# EAGLE design PotyEEG_v9 (EAGLE 9.6.2)
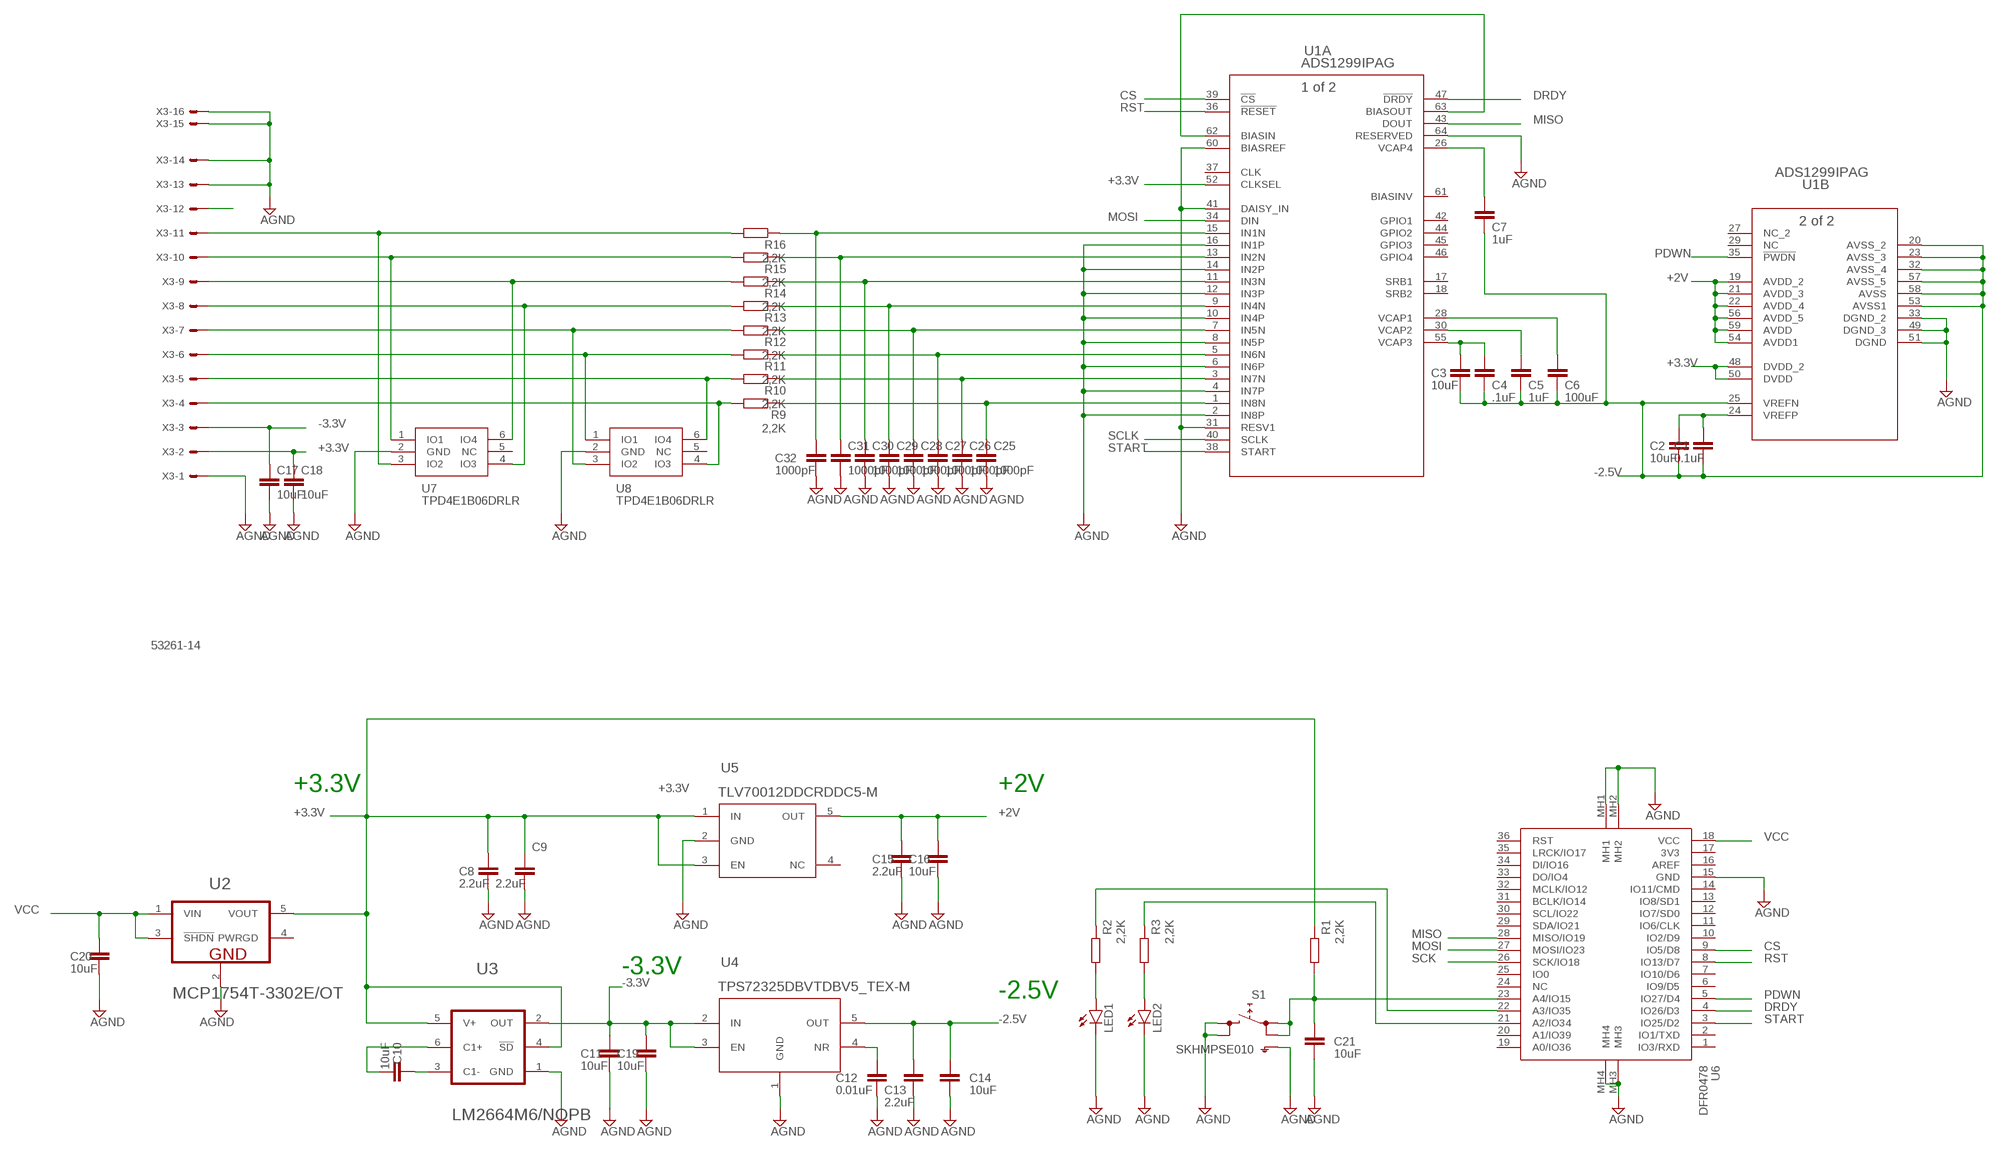
[diagram p0: schematic, sheet 1]

## Parts
C1  0.1uF  C-EUC0805K  [C0805K]
C2  10uF  C-EUC0805K  [C0805K]
C3  10uF  C-EUC0805K  [C0805K]
C4  .1uF  C-EUC0805K  [C0805K]
C5  1uF  C-EUC0805K  [C0805K]
C6  100uF  C-EUC0805K  [C0805K]
C7  1uF  C-EUC0805K  [C0805K]
C8  2.2uF  C-EUC0805K  [C0805K]
C9  2.2uF  C-EUC0805K  [C0805K]
C10  10uF  C-EUC0805K  [C0805K]
C11  10uF  C-EUC0805K  [C0805K]
C12  0.01uF  C-EUC0805K  [C0805K]
C13  2.2uF  C-EUC0805K  [C0805K]
C14  10uF  C-EUC0805K  [C0805K]
C15  2.2uF  C-EUC0805K  [C0805K]
C16  10uF  C-EUC0805K  [C0805K]
C17  10uF  C-EUC0603  [C0603]
C18  10uF  C-EUC0603  [C0603]
C19  10uF  C-EUC0805K  [C0805K]
C20  10uF  C-EUC0805K  [C0805K]
C21  10uF  C-EUC0805K  [C0805K]
C25  1000pF  C-EUC0603  [C0603]
C26  1000pF  C-EUC0603  [C0603]
C27  1000pF  C-EUC0603  [C0603]
C28  1000pF  C-EUC0603  [C0603]
C29  1000pF  C-EUC0603  [C0603]
C30  1000pF  C-EUC0603  [C0603]
C31  1000pF  C-EUC0603  [C0603]
C32  1000pF  C-EUC0603  [C0603]
LED1  LEDSML0805  [SML0805]
LED2  LEDSML0805  [SML0805]
R1  2,2K  R-EU_R0603  [R0603]
R2  2,2K  R-EU_R0603  [R0603]
R3  2,2K  R-EU_R0603  [R0603]
R9  2,2K  R-EU_R0603  [R0603]
R10  2,2K  R-EU_R0603  [R0603]
R11  2,2K  R-EU_R0603  [R0603]
R12  2,2K  R-EU_R0603  [R0603]
R13  2,2K  R-EU_R0603  [R0603]
R14  2,2K  R-EU_R0603  [R0603]
R15  2,2K  R-EU_R0603  [R0603]
R16  2,2K  R-EU_R0603  [R0603]
S1  SKHMPSE010  [SKHMPXE010]
U1  ADS1299IPAG  [PAG64_TEX]
U2  MICROCHIP_MCP1754T-3302E-OTMICROCHIP_MCP1754T-3302E-OT_0_1  [MICROCHIP_MCP1754T-3302E-OT_1]
U3  TEXAS_INSTRUMENTS_LM2664M6-NOPBTEXAS_INSTRUMENTS_LM2664M6-NOPB_0_2  [TEXAS_INSTRUMENTS_LM2664M6-NOPB_2]
U4  TPS72325DBVTDBV5_TEX-M  [DBV5_TEX-M]
U5  TLV70012DDCRDDC5-M  [DDC5-M]
U6  DFR0478  [FIREBEETLE_ESP32]
U7  TPD4E1B06DRLR  [SOP50P160X60-6N]
U8  TPD4E1B06DRLR  [SOP50P160X60-6N]
X3  53261-14  [53261-14]

## Nets
+2V: C15.1 C16.1 U1.19(B:AVDD_2) U1.21(B:AVDD_3) U1.22(B:AVDD_4) U1.54(B:AVDD1) U1.56(B:AVDD_5) U1.59(B:AVDD) U5.5(OUT)
+3.3V: C8.1 C9.1 C18.1 R1.1 U1.48(B:DVDD_2) U1.50(B:DVDD) U1.52(A:CLKSEL) U2.5(VOUT) U3.4(!SD!) U3.5(V+) U5.1(IN) U5.3(EN) X3.2
-2.5V: C1.2 C2.2 C3.2 C4.2 C5.2 C6.2 C7.2 C13.1 C14.1 U1.20(B:AVSS_2) U1.23(B:AVSS_3) U1.25(B:VREFN) U1.32(B:AVSS_4) U1.53(B:AVSS1) U1.57(B:AVSS_5) U1.58(B:AVSS) U4.5(OUT)
-3.3V: C11.1 C17.1 C19.1 U3.2(OUT) U4.2(IN) U4.3(EN) X3.3
CS: U1.39(A:!CS) U6.9(IO5/D8)
DRDY: U1.47(A:!DRDY) U6.4(IO26/D3)
GND: C8.2 C9.2 C11.2 C12.2 C13.2 C14.2 C15.2 C16.2 C17.2 C18.2 C19.2 C20.2 C21.2 C25.2 C26.2 C27.2 C28.2 C29.2 C30.2 C31.2 C32.2 LED1.C LED2.C S1.3(2.1) S1.4(2.2) S1.5(SH) U1.2(A:IN8P) U1.4(A:IN7P) U1.6(A:IN6P) U1.8(A:IN5P) U1.10(A:IN4P) U1.12(A:IN3P) U1.14(A:IN2P) U1.16(A:IN1P) U1.31(A:RESV1) U1.33(B:DGND_2) U1.41(A:DAISY_IN) U1.49(B:DGND_3) U1.51(B:DGND) U1.60(A:BIASREF) U1.64(A:RESERVED) U2.2(GND) U3.1(GND) U4.1(GND) U5.2(GND) U6.15(GND) U6.MH1 U6.MH2 U6.MH3 U6.MH4 U7.2(GND) U8.2(GND) X3.1 X3.13 X3.14 X3.S1 X3.S2 ; supply symbol labelled AGND
MISO: U1.43(A:DOUT) U6.28(MISO/IO19)
MOSI: U1.34(A:DIN) U6.27(MOSI/IO23)
N$1: C1.1 C2.1 U1.24(B:VREFP)
N$2: C3.1 C4.1 U1.55(A:VCAP3)
N$3: C5.1 U1.30(A:VCAP2)
N$4: C6.1 U1.28(A:VCAP1)
N$5: C7.1 U1.26(A:VCAP4)
N$6: C21.1 R1.2 S1.1(1.1) S1.2(1.2) U6.23(A4/IO15)
N$7: X3.12
N$8: R9.2 U8.4(IO3) X3.4
N$9: R10.2 U8.6(IO4) X3.5
N$10: R11.2 U8.1(IO1) X3.6
N$11: R2.1 U6.22(A3/IO35)
N$12: R12.2 U8.3(IO2) X3.7
N$13: C12.1 U4.4(NR)
N$14: R13.2 U7.4(IO3) X3.8
N$15: C10.1 U3.3(C1-)
N$16: C10.2 U3.6(C1+)
N$17: R14.2 U7.6(IO4) X3.9
N$18: LED1.A R2.2
N$19: R15.2 U7.1(IO1) X3.10
N$20: U1.62(A:BIASIN) U1.63(A:BIASOUT)
N$21: R3.1 U6.21(A2/IO34)
N$22: LED2.A R3.2
N$31: C25.1 R9.1 U1.1(A:IN8N)
N$32: C26.1 R10.1 U1.3(A:IN7N)
N$33: C27.1 R11.1 U1.5(A:IN6N)
N$34: C28.1 R12.1 U1.7(A:IN5N)
N$35: C29.1 R13.1 U1.9(A:IN4N)
N$36: C30.1 R14.1 U1.11(A:IN3N)
N$37: C31.1 R15.1 U1.13(A:IN2N)
N$38: C32.1 R16.1 U1.15(A:IN1N)
N$41: R16.2 U7.3(IO2) X3.11
PDWN: U1.35(B:!PWDN) U6.5(IO27/D4)
RST: U1.36(A:!RESET) U6.8(IO13/D7)
SCK: U6.26(SCK/IO18)
SCLK: U1.40(A:SCLK)
START: U1.38(A:START) U6.3(IO25/D2)
VCC: C20.1 U2.1(VIN) U2.3(!SHDN!) U6.18(VCC)
Unconnected: U1.17(A:SRB1) U1.18(A:SRB2) U1.27(B:NC_2) U1.29(B:NC) U1.37(A:CLK) U1.42(A:GPIO1) U1.44(A:GPIO2) U1.45(A:GPIO3) U1.46(A:GPIO4) U1.61(A:BIASINV) U2.4(PWRGD) U5.4(NC) U6.1(IO3/RXD) U6.2(IO1/TXD) U6.6(IO9/D5) U6.7(IO10/D6) U6.10(IO2/D9) U6.11(IO6/CLK) U6.12(IO7/SD0) U6.13(IO8/SD1) U6.14(IO11/CMD) U6.16(AREF) U6.17(3V3) U6.19(A0/IO36) U6.20(A1/IO39) U6.24(NC) U6.25(IO0) U6.29(SDA/IO21) U6.30(SCL/IO22) U6.31(BCLK/IO14) U6.32(MCLK/IO12) U6.33(DO/IO4) U6.34(DI/IO16) U6.35(LRCK/IO17) U6.36(RST) U7.5(NC) U8.5(NC)

## Notes on the sheet
- +3.3V | +2V
- -3.3V
- -2.5V

## Library data of the parts
C1-C21 C25-C32 = rcl:C-EU: CAPACITOR, European symbol; SPICEPREFIX: C
LED1 LED2 = led:LED: LED OSRAM: - CHIPLED LG R971, LG N971, LY N971, LG Q971, LY Q971, LO R971, LY R971 LH N974, LH R974 LS Q976, LO Q976, LY Q976 LO Q996 - Hyper CHIPLED LW Q18S LB Q993, LB Q99A, LB R99A - SideLED LS A670, LO A670, LY A670, LG A670, LP A670 LB A673, LV A673, LT A673, LW A673 LH A674 LY A675 LS A676, LA A676, LO A676, LY A676, LW A676 LS A679, LY A679, LG A679 - Hyper Micro SIDELED® LS Y876, LA Y876, LO Y876, LY Y876 LT Y87S - SmartLED LW L88C, LW L88S LB L89C, LB L89S, LG L890 LS L89K, LO L89K, LY L89K LS L896, LA L896, LO L896, LY L896 - TOPLED LS T670, LO T670, LY T670, LG T670, LP T670 LSG T670, LSP T670, LSY T670, LOP T670, LYG T670 LG T671, LOG T671, LSG T671 LB T673, LV T673, LT T673, LW T673 LH T674 LS T676, LA T676, LO T676, LY T676, LB T676, LH T676, LSB T676, LW T676 LB T67C, LV T67C, LT T67C, LS T67K, LO T67K, LY T67K, LW E67C LS E67B, LA E67B, LO E67B, LY E67B, LB E67C, LV E67C, LT E67C LW T67C LS T679, LY T679, LG T679 LS T770, LO T770, LY T770, LG T770, LP T770 LB T773, LV T773, LT T773, LW T773 LH T774 LS E675, LA E675, LY E675, LS T675 LS T776, LA T776, LO T776, LY T776, LB T776 LHGB T686 LT T68C, LB T68C - Hyper Mini TOPLED® LB M676 - Mini TOPLED Santana® LG M470 LS M47K, LO M47K, LY M47K Source: http://www.osram.convergy.de LUXEON: - LUMILED® LXK2-PW12-R00, LXK2-PW12-S00, LXK2-PW14-U00, LXK2-PW14-V00 LXK2-PM12-R00, LXK2-PM12-S00, LXK2-PM14-U00 LXK2-PE12-Q00, LXK2-PE12-R00, LXK2-PE12-S00, LXK2-PE14-T00, LXK2-PE14-U00 LXK2-PB12-K00, LXK2-PB12-L00, LXK2-PB12-M00, LXK2-PB14-N00, LXK2-PB14-P00, LXK2-PB14-Q00 LXK2-PR12-L00, LXK2-PR12-M00, LXK2-PR14-Q00, LXK2-PR14-R00 LXK2-PD12-Q00, LXK2-PD12-R00, LXK2-PD12-S00 LXK2-PH12-R00, LXK2-PH12-S00 LXK2-PL12-P00, LXK2-PL12-Q00, LXK2-PL12-R00 Source: www.luxeon.com KINGBRIGHT: KA-3528ASYC Source: www.kingbright.com
R1-R3 R9-R16 = rcl:R-EU_: RESISTOR, European symbol; SPICEPREFIX: R
S1 = switch:SKHMP*E010: 6.2 X 6.5mm TACT Switch (SMD) Source: http://www3.alps.co.jp/WebObjects/catalog.woa/PDF/E/Switch/Tact/SKHM/SKHM.PDF
U1 = ads1299 functional:ADS1299IPAG; BUILT_BY: EMA_UL_Team; MANUFACTURER_PART_NUMBER: ADS1299IPAG; SOURCELIBRARY: TI_2015-1-5; VENDOR: Texas Instruments
U2 = MCP1754T-3302:MICROCHIP_MCP1754T-3302E-OT: MCHP-MCP1754-SOT-23-5; CIIVA_IDS: 1500925; COMPONENT_LINK_1_DESCRIPTION: Manufacturer URL; COMPONENT_LINK_1_URL: http://www.microchip.com; COMPONENT_LINK_3_DESCRIPTION: Package Specification; COMPONENT_LINK_3_URL: http://www.microchip.com/stellent/groups/techpub_sg/documents/packagingspec/en012702.pdf; COMPONENT_LINK_4_DESCRIPTION: Product URL; COMPONENT_LINK_4_URL: http://www.microchip.com/MCP1754; DATASHEET: http://ww1.microchip.com/downloads/en/DeviceDoc/22276A.pdf; DATASHEET_VERSION: Rev. A; FOOTPRINT_VARIANT_NAME_0: Level C; FOOTPRINT_VARIANT_NAME_1: Level B; FOOTPRINT_VARIANT_NAME_2: Level A; IMPORTED: yes; IMPORTED_FROM: vault; IMPORT_TS: 1521843520; MF: Microchip; MOUNTING_TECHNOLOGY: Surface Mount; MPN: MCP1754T-3302E/OT; PACKAGE: SOT-23-OT5; PACKAGE_DESCRIPTION: 5-Lead Plastic Small Outline Transistor, 2.9 x 1.55 mm Body, 0.95 mm Pitch; PACKAGE_VERSION: C04-091B; PREFIX: U; RELEASE_DATE: 1359988692; VAULT_GUID: 3A33CF96-43B5-4723-873A-C9F2F5F09FFF; VAULT_REVISION: A9278915-1F13-43B8-98C3-18563D2C7A01
U3 = LM2664:TEXAS_INSTRUMENTS_LM2664M6-NOPB: PM-CHP-LM2664M6-6; CIIVA_IDS: 19361147; CODE__IPC: SOT26A-6; CODE__JEDEC: MO-178-AB; COMPONENT_LINK_1_DESCRIPTION: Datasheet URL; COMPONENT_LINK_1_URL: http://www.ti.com/general/docs/lit/getliterature.tsp?genericPartNumber=LM2664&fileType=pdf; COMP_TYPE: Switch Caps; FOOTPRINT_VARIANT_NAME_0: Level C; FOOTPRINT_VARIANT_NAME_1: Level B; FOOTPRINT_VARIANT_NAME_2: Level A; IMPORTED: yes; IMPORTED_FROM: vault; IMPORT_TS: 1521864087; MF: Texas Instruments; MPN: LM2664M6/NOPB; PACKAGE: DBV0006A; PACKAGE_DESCRIPTION: Molded SOT-23, .115 x .063 x .040in Body, 6 Lead, .0375in in Pitch; PACKAGE_TOP_MARKING: S03A*XTT; PIN_COUNT: 6; POWER_WISE: N; PREFIX: U; RELEASE_DATE: 1464079872; ROHS: Yes; VAULT_GUID: 34B9379D-887B-4667-A034-6510912F99CF; VAULT_REVISION: D99320BA-DF10-4148-ADE2-61DB7AE1F07E
U4 = TPS72325:TPS72325DBVT; BUILT_BY: EMA_UL_Team; MANUFACTURER: Texas Instruments; MANUFACTURER_PART_NUMBER: TPS72325DBVT; SOURCELIBRARY: TI_2014-08-19; VENDOR: Texas Instruments
U5 = TLV70012:TLV70012DDCR; DATASHEET_URL: http://www.ti.com/lit/gpn/TLV70012; DESCRIPTION: 200mA, Low IQ, Low Dropout Regulator for Portables; FAMILY_NAME: SINGLE CHANNEL LDO; GENERIC_PART_NUMBER: TLV70012; INDUSTRY_STD_PKG_TYPE: SOT; MANUFACTURER: Texas Instruments; MANUFACTURER_PART_NUMBER: TLV70012DDCR; PACKAGE_DESIGNATOR: DDC; PIN_COUNT: 5; VENDOR: Texas Instruments
U6 = DFR0478_V2:DFR0478: Development Boards & Kits - Wireless FireBeetle ESP32 IOT MCU Source: Datasheet <https://github.com/Robert-MARKII/Document/blob/master/FireBeetle Board-ESP32 User Manual update.pdf>; ARROW_PART_NUMBER: DFR0478; ARROW_PRICE-STOCK: https://www.arrow.com/en/products/dfr0478/dfrobot; DESCRIPTION: Development Boards & Kits - Wireless FireBeetle ESP32 IOT MCU; HEIGHT: mm; MANUFACTURER_NAME: DFRobot; MANUFACTURER_PART_NUMBER: DFR0478; MOUSER_PART_NUMBER: 426-DFR0478; MOUSER_PRICE-STOCK: https://www.mouser.co.uk/ProductDetail/DFRobot/DFR0478?qs=EU6FO9ffTwc%252BR65h2NUGQw%3D%3D
U7 U8 = TPD4E1B06DRLR:TPD4E1B06DRLR: Bidirectional Quad-Channel High-Speed ESD Protection Device Source: Datasheet <http://www.ti.com/lit/ds/symlink/tpd4e1b06.pdf>; ARROW_PART_NUMBER: TPD4E1B06DRLR; ARROW_PRICE-STOCK: https://www.arrow.com/en/products/tpd4e1b06drlr/texas-instruments; DESCRIPTION: Bidirectional Quad-Channel High-Speed ESD Protection Device; HEIGHT: 0.6mm; MANUFACTURER_NAME: Texas Instruments; MANUFACTURER_PART_NUMBER: TPD4E1B06DRLR; MOUSER_PART_NUMBER: 595-TPD4E1B06DRLR; MOUSER_PRICE-STOCK: https://www.mouser.co.uk/ProductDetail/Texas-Instruments/TPD4E1B06DRLR?qs=1MXlzafEN387aRSX0e2MEQ%3D%3D
X3 = con-molex-53261-14:53?-14: CONNECTOR wire to board 1.25 mm (.049 inch) pitch header; MF: MOLEX; OC_FARNELL: 1125364; OC_NEWARK: unknown

## Board
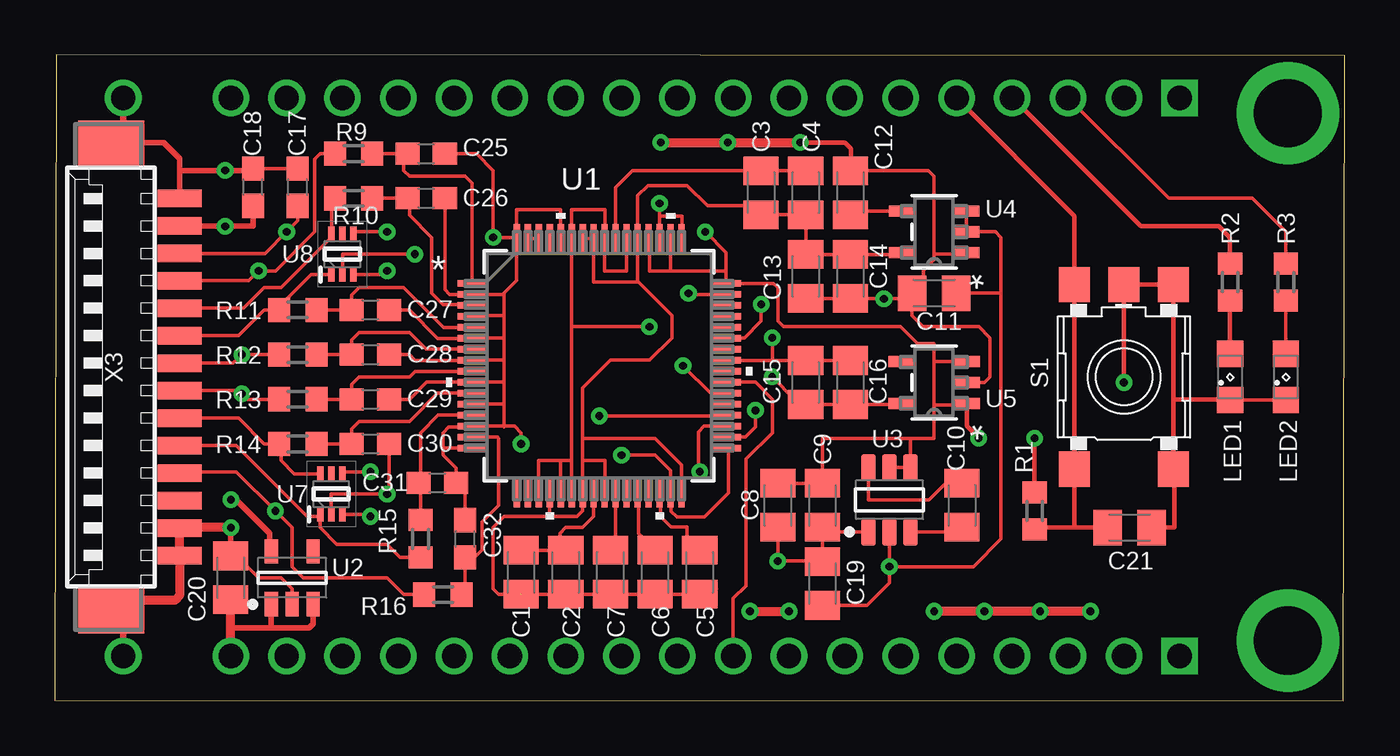
[diagram p1: board, top side]
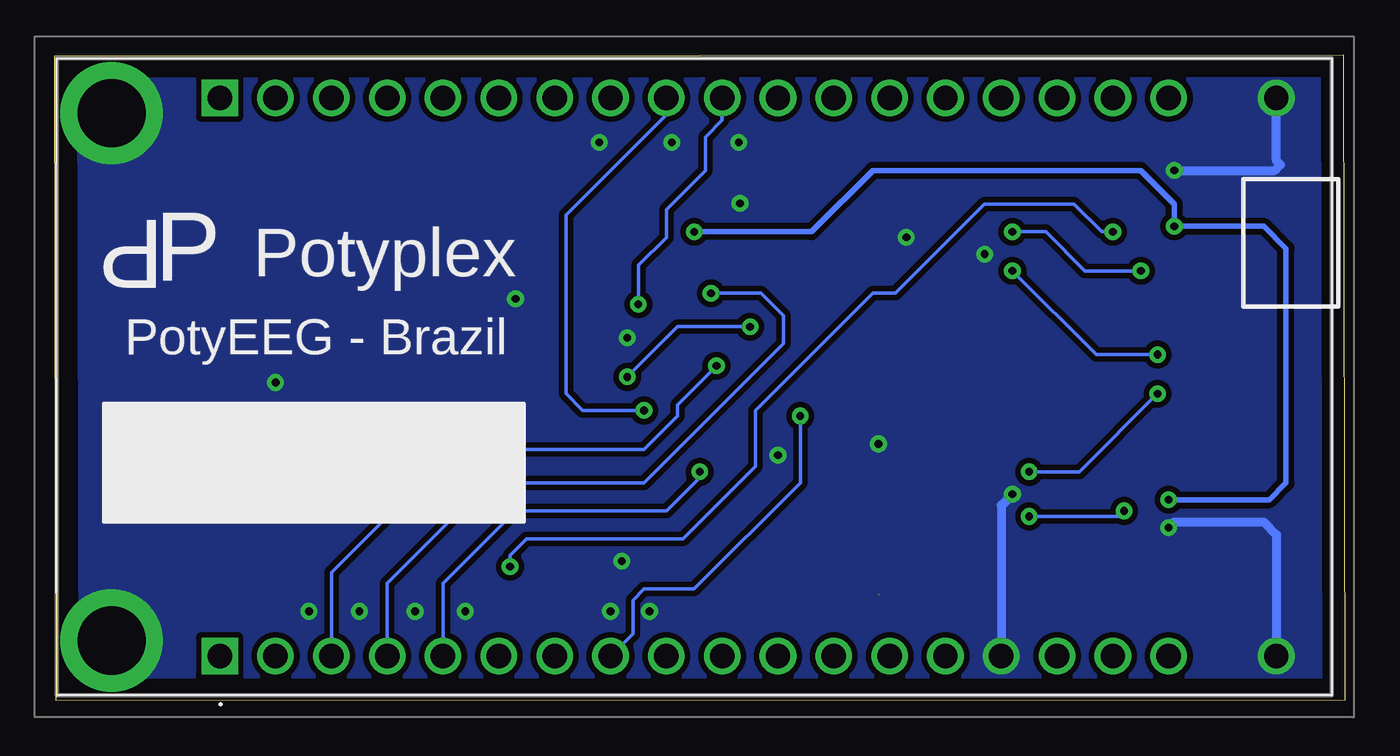
[diagram p2: board, bottom side, seen from below]

Size 58.68 x 29.39 mm. Coordinates in mm from the lower left corner, seen from the top.
Outline: 0,0.02 58.63,0 58.68,29.36 0.05,29.39 0,0.02
Copper layers (1*16): Top 0.035mm / dielectric 1.5mm / Bottom 0.035mm
Design rules "default": minimum track width 6mil, minimum drill 0.35mm, track to track 6mil, track to pad 6mil, pad to pad 6mil, via to via 6mil, smd to smd 6mil, copper to edge 40mil, drill to drill 6mil, minimum pad ring 10mil, minimum via ring 8mil, stop-mask expansion 4mil, vias tented up to drill 0mil, thermal gap 10mil

### Footprints (pad centres in the part's own frame; a part is rotated, then mirrored left to right if it is on the bottom)
C0805K = smd 1.3 x 1.6: 1 -1,0; 2 1,0
C0603 = smd 1.1 x 1: 1 -0.85,0; 2 0.85,0
SML0805 = smd 1.2 x 1.2: A 1.05,0; C -1.05,0
R0603 = smd 1 x 1.1: 1 -0.85,0; 2 0.85,0
SKHMPXE010 = smd 1.6 x 1.4: 1 -4.2,2.25; 2 4.2,2.25; 3 -4.2,-2.25; 4 4.2,-2.25; 5 4.2,0
PAG64_TEX = smd 1.346 x 0.279: 1 -5.779,3.75; 2 -5.779,3.25; 3 -5.779,2.75; 4 -5.779,2.25; 5 -5.779,1.75; 6 -5.779,1.25; 7 -5.779,0.75; 8 -5.779,0.25; 9 -5.779,-0.25; 10 -5.779,-0.75; 11 -5.779,-1.25; 12 -5.779,-1.75; 13 -5.779,-2.25; 14 -5.779,-2.75; 15 -5.779,-3.25; 16 -5.779,-3.75; 33 5.779,-3.75; 34 5.779,-3.25; 35 5.779,-2.75; 36 5.779,-2.25; 37 5.779,-1.75; 38 5.779,-1.25; 39 5.779,-0.75; 40 5.779,-0.25; 41 5.779,0.25; 42 5.779,0.75; 43 5.779,1.25; 44 5.779,1.75; 45 5.779,2.25; 46 5.779,2.75; 47 5.779,3.25; 48 5.779,3.75 | smd 0.279 x 1.346: 17 -3.75,-5.779; 18 -3.25,-5.779; 19 -2.75,-5.779; 20 -2.25,-5.779; 21 -1.75,-5.779; 22 -1.25,-5.779; 23 -0.75,-5.779; 24 -0.25,-5.779; 25 0.25,-5.779; 26 0.75,-5.779; 27 1.25,-5.779; 28 1.75,-5.779; 29 2.25,-5.779; 30 2.75,-5.779; 31 3.25,-5.779; 32 3.75,-5.779; 49 3.75,5.779; 50 3.25,5.779; 51 2.75,5.779; 52 2.25,5.779; 53 1.75,5.779; 54 1.25,5.779; 55 0.75,5.779; 56 0.25,5.779; 57 -0.25,5.779; 58 -0.75,5.779; 59 -1.25,5.779; 60 -1.75,5.779; 61 -2.25,5.779; 62 -2.75,5.779; 63 -3.25,5.779; 64 -3.75,5.779
MICROCHIP_MCP1754T-3302E-OT_1 = smd 1.1 x 0.6: 1 -1.2,0.95; 2 -1.2,0; 3 -1.2,-0.95; 4 1.2,-0.95; 5 1.2,0.95
TEXAS_INSTRUMENTS_LM2664M6-NOPB_2 = smd 1.2 x 0.65: 1 -1.475,0.95; 2 -1.475,0; 3 -1.475,-0.95; 4 1.475,-0.95; 5 1.475,0; 6 1.475,0.95
DBV5_TEX-M = smd 1.181 x 0.508: 1 -1.467,0.95; 2 -1.467,0; 3 -1.467,-0.95; 4 1.467,-0.95; 5 1.467,0.95
DDC5-M = smd 1.206 x 0.508: 1 -1.48,0.95; 2 -1.48,0; 3 -1.48,-0.95; 4 1.48,-0.95; 5 1.48,0.95
FIREBEETLE_ESP32 = drill 1.11 pad 1.665 square: 1 25.4,12.7; 19 25.4,-12.7 | drill 1.11 pad 1.665: 2 22.86,12.7; 3 20.32,12.7; 4 17.78,12.7; 5 15.24,12.7; 6 12.7,12.7; 7 10.16,12.7; 8 7.62,12.7; 9 5.08,12.7; 10 2.54,12.7; 11 0,12.7; 12 -2.54,12.7; 13 -5.08,12.7; 14 -7.62,12.7; 15 -10.16,12.7; 16 -12.7,12.7; 17 -15.24,12.7; 18 -17.78,12.7; 20 22.86,-12.7; 21 20.32,-12.7; 22 17.78,-12.7; 23 15.24,-12.7; 24 12.7,-12.7; 25 10.16,-12.7; 26 7.62,-12.7; 27 5.08,-12.7; 28 2.54,-12.7; 29 0,-12.7; 30 -2.54,-12.7; 31 -5.08,-12.7; 32 -7.62,-12.7; 33 -10.16,-12.7; 34 -12.7,-12.7; 35 -15.24,-12.7; 36 -17.78,-12.7; MH1 -22.677,-12.7; MH2 -22.677,12.7 | drill 3.1 pad 4.65: MH3 30.323,12; MH4 30.323,-12
SOP50P160X60-6N = smd 0.65 x 0.3: 1 -0.925,0.5; 2 -0.925,0; 3 -0.925,-0.5; 4 0.925,-0.5; 5 0.925,0; 6 0.925,0.5
53261-14 = smd 0.8 x 2: 1 8.125,-2.5; 2 6.875,-2.5; 3 5.625,-2.5; 4 4.375,-2.5; 5 3.125,-2.5; 6 1.875,-2.5; 7 0.625,-2.5; 8 -0.625,-2.5; 9 -1.875,-2.5; 10 -3.125,-2.5; 11 -4.375,-2.5; 12 -5.625,-2.5; 13 -6.875,-2.5; 14 -8.125,-2.5 | smd 2.1 x 3: S1 10.625,0.625; S2 -10.625,0.625

### Placement (x,y rotation side)
C1  21.21,5.84 270 top
C2  23.24,5.84 270 top
C3  32.13,23.11 270 top
C4  34.16,23.11 270 top
C5  29.34,5.84 270 top
C6  27.3,5.84 270 top
C7  25.27,5.84 270 top
C8  32.89,8.89 270 top
C9  34.93,8.89 270 top
C10  41.27,8.89 90 top
C11  40.01,18.54 180 top
C12  36.2,23.11 90 top
C13  34.16,19.3 270 top
C14  36.2,19.3 270 top
C15  34.16,14.48 90 top
C16  36.2,14.48 90 top
C17  11.05,23.37 90 top
C18  9.02,23.37 90 top
C19  34.93,5.33 90 top
C20  8,5.59 90 top
C21  48.9,7.87 0 top
C25  16.89,24.89 0 top
C26  16.89,22.86 0 top
C27  14.35,17.78 0 top
C28  14.35,15.75 0 top
C29  14.35,13.72 0 top
C30  14.35,11.68 0 top
C31  17.4,9.91 0 top
C32  18.67,7.37 90 top
LED1  53.47,14.73 90 top
LED2  56.01,14.73 90 top
R1  44.58,8.64 270 top
R2  53.47,19.05 270 top
R3  56.01,19.05 270 top
R9  13.59,24.89 180 top
R10  13.59,22.86 180 top
R11  11.05,17.78 180 top
R12  11.05,15.75 180 top
R13  11.05,13.72 180 top
R14  11.05,11.68 180 top
R15  16.64,7.37 270 top
R16  17.65,4.83 180 top
S1  48.64,14.73 90 top
U1  24.77,15.24 0 top
U2  10.8,5.59 90 top
U3  37.97,9.14 90 top
U4  40.01,21.34 180 top
U5  40.01,14.48 180 top
U6  25.78,14.73 180 bottom
U7  12.57,9.4 90 top
U8  13.08,20.32 90 top
X3  3.18,14.73 90 top

### Tracks (layer width: path | path; a pad name or v marks a point on that pad's centre or on a via)
+2V  (via drill 0.35)
  Top 0.152: U1.54 26.02,19.56 25.02,19.56 U1.56 25.02,22.35 23.49,22.35 23.49,21.02 U1.59 23.52,17.02 | U1.22 23.52,10.92 | U1.19 22.02,10.92 23.02,10.92 | 23.02,10.92 23.52,10.92 | U1.21 23.02,10.92 | 23.52,10.92 23.52,17.02 | v27.05,17.02 23.52,17.02 | U5.5 38.48,13.48 C16.1 C15.1 33.93,13.72 33.66,13.72 v32.64,14.73
  Bottom 0.152: v32.64,14.73 30.35,17.02 v27.05,17.02
+3.3V  (via drill 0.35)
  Top 0.152: 28.02,19.56 27.05,19.56 27.05,21.02 U1.52 | U1.50 28.02,19.56 | 38.99,11.94 34.93,11.94 C9.1 32.91,9.89 32.89,9.91 32.91,9.91 C8.1 | 30.54,19.56 U1.48 32.7,18.99 32.89,18.8 32.89,17.27 33.15,17.02 38.48,17.02 39.24,16.26 40.01,16.26 40.01,15.49 | 28.02,19.56 30.54,19.56 | 40.01,13.46 41.42,13.46 U5.1 | 40.01,13.46 40.01,15.49 | 38.99,11.94 40.01,11.94 40.01,13.46 | 38.99,11.94 38.92,11.87 U3.4 U3.5 | X3.2 5.69,21.59 | v29.59,21.34 30.54,20.38 30.54,19.56 | U5.3 40.07,15.43 40.01,15.49
  Top 0.203: U5.1 41.49,12.49 v42.04,11.94 | v44.58,11.94 R1.1
  Top 0.254: C18.1 9.02,21.59 v7.75,21.59 5.69,21.59 | U2.5 9.78,6.85 9.78,7.62 8.26,9.14 v8,9.14
  Bottom 0.203: v42.04,11.94 v44.58,11.94
  Bottom 0.254: v8,9.14 3.43,9.14 2.67,9.91 2.67,20.57 3.68,21.59 v7.75,21.59 7.75,22.61 9.27,24.13 21.46,24.13 24.26,21.34 v29.59,21.34
-2.5V  (1 unrouted)
  Top 0.152: U1.20 22.52,8.38 | U1.58 U1.57 24.51,19.05 26.52,19.05 | 26.52,19.05 U1.53 26.52,22.98 26.98,23.44 28.77,23.44 29.68,22.53 31.71,22.53 C3.2 C4.2 C13.1 C14.1 38.46,20.3 U4.5 | 26.52,19.05 26.54,19.05 28.07,17.53 28.07,16.51 27.05,15.49 25.27,15.49 24,14.22 24,11.94 | 24,10.92 U1.23 24,9.45 24,8.64 23.75,8.38 22.52,8.38 | U1.25 25.02,10.92 24,10.92 | 30.1,5.08 29.57,5.08 C5.2 C6.2 C7.2 C2.2 C1.2 | 22.52,8.38 20.45,8.38 19.94,7.87 19.94,5.08 20.19,4.83 21.19,4.83 | 24,11.94 24,10.92 | U1.32 28.52,10.73 27.3,11.94 24,11.94
-3.3V  (via drill 0.35)
  Top 0.152: U4.3 U4.2 42.8,21.34 43.05,21.08 43.05,18.54 | 43.05,18.54 C11.1 | 43.05,18.54 43.05,7.37 41.78,6.1 v37.97,6.1 | X3.3 9.56,20.36 v10.54,21.34 11.05,21.84 C17.1 | U3.2 v37.97,6.1 | v37.97,6.1 37.97,5.35 36.96,4.33 C19.1
  Bottom 0.152: v10.54,21.34 11.05,21.34 12.32,22.61 16.38,22.61 20.45,18.54 21.46,18.54 26.8,13.21 26.8,10.67 30.1,7.37 37.21,7.37 37.97,6.6 v37.97,6.1
CS
  Top 0.152: U6.9 30.86,4.65 31.45,5.23 31.45,11 32.64,12.19 32.64,13.72 31.87,14.49 U1.39
DRDY  (via drill 0.35)
  Top 0.152: U1.47 28.88,18.49 v28.83,18.54
  Bottom 0.152: U6.4 43.56,5.33 38.99,9.91 31.88,9.91 25.53,16.26 25.53,17.53 26.54,18.54 v28.83,18.54
GND  (via drill 0.35)
  Top 0.152: U3.1 35.15,7.67 35.06,7.75 | 35.06,7.75 C9.2 | 21.02,21.08 U1.64 21.02,19.11 20.45,18.54 | 21.02,21.08 21.02,22.35 23.02,22.35 U1.60 | 39.01,18.29 C11.2 39.51,19.05 39.51,19.57 40.01,20.07 40.01,20.32 | 20.45,18.54 20.45,17.53 | 20.45,17.53 20.45,16.51 | 20.45,16.51 20.45,15.49 | 20.45,15.49 20.45,14.48 | 20.45,14.48 20.45,13.46 | 20.45,13.46 20.45,12.45 20.4,12.49 U1.14 | U1.4 19.02,17.53 20.45,17.53 | 20.45,16.51 19.01,16.51 U1.6 17.42,16.49 16.13,17.78 C27.2 | 20.45,15.49 U1.8 16.39,15.49 16.13,15.75 C28.2 | 20.45,14.48 20.44,14.49 U1.10 16.9,14.49 16.13,13.72 C29.2 | 20.45,18.54 20.4,18.49 U1.2 17.96,18.49 17.74,18.71 C26.2 | v25.78,11.18 27.3,11.18 28.02,10.47 U1.31 28.04,9.43 28.04,8.61 28.3,8.36 29.57,8.36 30.66,9.45 30.66,11.38 U1.33 | C13.2 C14.2 36.21,18.29 v37.72,18.29 39.01,18.29 | C16.2 C15.2 33.66,15.48 33.64,15.49 32.64,15.49 | U5.2 42.29,14.48 42.55,14.73 42.55,16.51 42.04,17.02 39.5,17.02 38.99,17.53 38.99,18.27 39.01,18.29 | C12.2 36.21,24.13 39.75,24.13 40.01,23.88 40.01,20.32 | U4.1 41.41,20.32 40.01,20.32 | U7.2 12.57,9.4 v15.11,9.4 15.2,9.49 C30.2 | U8.2 13.08,20.32 v16.38,20.32 | 21.02,21.08 v19.94,21.08 19.94,24.13 19.18,24.89 C25.2 | C17.2 C18.2 9.02,24.13 | X3.13 X3.14 | 5.93,7.87 5.68,7.62 | C8.2 v32.89,6.35 34.91,6.35 C19.2 34.93,7.62 35.06,7.75 | U1.41 32.64,15.49 | v32.64,16.51 32.64,15.49 | U2.2 10.8,5.08 10.29,5.59 9.27,5.59 8.27,6.59 C20.2 | v21.21,11.68 21.21,12.19 20.91,12.49 U1.14 | U1.14 18.94,12.45 17.91,12.45 17.65,12.19 17.65,11.43 | 17.65,11.43 17.65,11.18 18.25,10.58 C31.2 18.67,9.49 C32.2 | U1.16 17.71,11.49 17.65,11.43 | U1.12 20.42,13.49 20.45,13.46
  Top 0.152: 2.92,4.57 2.55,4.2 X3.S2 | U6.MH1 3.18,27.36 3.18,25.4 2.59,25.4 X3.S1 2.92,25.72 | LED2.C LED1.C | U1.51 27.52,22.05 | 27.52,22.05 28.52,22.05 28.52,21.03 U1.49 | 27.52,22.05 v27.52,22.62 v27.51,22.63
  Top 0.203: 50.89,13.72 S1.3 50.93,10.5 50.93,7.87 C21.2 | 50.89,13.72 S1.4 S1.5 v48.64,14.48 | LED1.C 53.43,13.72 50.89,13.72 | v33.91,25.4 35.94,25.4 36.21,25.13 36.21,24.13
  Top 0.254: v8,7.87 C20.2 | X3.1 5.68,24.13 | 5.68,24.13 5.68,24.68 4.95,25.4 3.18,25.4 | 9.02,24.13 v7.75,24.13 5.68,24.13
  Top 0.305: X3.S2 3.1,3.55 U6.MH2 | U6.MH1 3.1,25.91 2.92,25.72
  Top 0.406: v8,7.87 5.93,7.87 | 5.68,7.62 X3.14 5.68,4.79 5.46,4.57 2.92,4.57 | v40.01,4.06 v42.29,4.06 v44.83,4.06 v47.12,4.06 | v27.56,25.4 v30.61,25.4 v33.91,25.4 | v31.62,4.06 v33.4,4.06
  Bottom 0.406: v15.11,9.4 15.62,8.89 U6.15 | v7.75,24.13 3.18,24.13 2.92,24.38 3.1,24.57 U6.MH1 | v8,7.87 7.75,8.13 3.68,8.13 3.1,7.55 U6.MH2
  pour Bottom (isolate 0.254, no thermals): 0.89,28.96 58.29,28.96 58.29,0.76 0.89,0.76
  pour Bottom: 53.21,3.56 53.21,0.25 58.29,0.25 58.29,3.56
  pour Bottom: 53.21,26.16 53.21,25.91 58.29,25.91 58.29,28.96 53.21,28.96
MISO  (via drill 0.35)
  Top 0.152: U1.43 30.56,16.51 31.37,16.51 32.13,17.27 v32.13,18.03
  Bottom 0.152: U6.28 28.32,26.42 29.08,25.65 29.08,24.13 30.86,22.35 30.86,21.08 32.13,19.81 v32.13,18.03
MOSI  (via drill 0.35)
  Top 0.152: U1.34 31.42,11.99 31.88,12.45 v31.88,13.21
  Bottom 0.152: v31.88,13.21 34.67,13.21 35.43,13.97 35.43,22.1 30.86,26.67 U6.27
N$1
  Top 0.152: C2.1 22.99,6.84 | U1.24 24.52,8.39 24,7.87 23.24,7.87 22.99,7.62 22.99,6.84 | C1.1 22.99,6.84
N$2
  Top 0.152: C4.1 C3.1 32.12,24.13 26.29,24.13 25.52,23.36 U1.55
N$3
  Top 0.152: U1.30 27.56,9.42 27.56,8.38 28.04,7.9 28.75,7.9 28.75,7.43 C5.1
N$4
  Top 0.152: C6.1 26.54,7.6 26.54,9.43 U1.28
N$5
  Top 0.152: U1.26 25.52,7.08 C7.1
N$6
  Top 0.203: R1.2 44.66,7.87 46.35,7.87 | 46.35,7.87 C21.1 | 46.35,7.87 46.39,7.91 S1.1 S1.2 46.39,22.06 U6.23
N$8  (via drill 0.35)
  Top 0.152: U8.4 13.58,21.34 v15.11,21.34 | R9.2 12.07,24.89 11.81,24.64 11.81,21.34 10.03,19.56 v9.27,19.56 8.82,19.11 X3.4
  Bottom 0.152: v9.27,19.56 11.81,19.56 13.59,21.34 v15.11,21.34
N$9
  Top 0.152: X3.5 8.59,17.86 9.53,18.8 10.29,18.8 12.58,21.09 U8.6 12.58,22.7 R10.2
N$10
  Top 0.152: X3.6 8.35,16.61 9.53,17.78 R11.2 10.2,17.95 11.65,19.39 U8.1
N$11
  Top 0.203: R2.1 53.47,21.08 52.96,21.59 49.4,21.59 U6.22
N$12  (via drill 0.35)
  Top 0.152: R12.2 v8.51,15.75 8.12,15.36 X3.7 | U8.3 14.95,19.39 v15.11,19.56
  Bottom 0.152: v15.11,19.56 11.3,15.75 v8.51,15.75
N$13
  Top 0.152: U4.4 36.37,22.29 C12.1
N$14  (via drill 0.35)
  Top 0.152: X3.8 8.37,14.11 v8.51,13.97 8.76,13.72 R13.2 | U7.4 13.16,10.41 v14.35,10.41
  Bottom 0.152: v8.51,13.97 12.07,10.41 v14.35,10.41
N$15
  Top 0.152: U3.3 41.05,7.67 C10.1
N$16
  Top 0.152: U3.6 37.02,9.14 39.77,9.14 40.51,9.89 C10.2
N$17
  Top 0.152: X3.9 8.35,12.86 9.53,11.68 R14.2 10.29,11.6 10.29,10.92 10.89,10.32 U7.6
N$18
  Top 0.203: R2.2 LED1.A
N$19
  Top 0.152: R15.2 15.71,6.52 15.11,7.11 12.83,7.11 12.07,7.87 12.07,7.88 U7.1 11.98,8.38 11.48,8.38 8.26,11.61 X3.10
N$20
  Top 0.152: U1.63 U1.62
N$21
  Top 0.152: U6.21 50.67,22.86 54.48,22.86 56.01,21.34 R3.1
N$22
  Top 0.152: R3.2 LED2.A
N$31
  Top 0.152: R9.1 C25.1 15.88,24.73 15.88,24.13 16.13,23.88 18.67,23.88 18.99,23.56 U1.1
N$32
  Top 0.152: U1.3 18.94,18.03 17.65,18.03 17.15,18.54 17.15,21.08 16.13,22.1 16.13,22.77 C26.1 R10.1
N$33
  Top 0.152: U1.5 17.68,16.99 15.88,18.8 13.84,18.8 13.5,18.45 C27.1 R11.1
N$34
  Top 0.152: U1.7 18.97,16 16.89,16 16.13,16.76 13.84,16.76 13.5,16.42 C28.1 R12.1
N$35
  Top 0.152: R13.1 C29.1 13.5,14.39 13.84,14.73 16.13,14.73 16.39,14.99 U1.9
N$36
  Top 0.152: U1.11 17.42,13.99 16.13,12.7 13.84,12.7 13.5,12.36 C30.1 R14.1
N$37
  Top 0.152: U1.13 17.44,12.99 16.64,12.19 16.64,9.99 C31.1 16.64,9.82 R15.1
N$38
  Top 0.152: U1.15 20.14,11.99 20.19,11.94 20.19,8.89 19.43,8.13 19.43,6.86 19.09,6.52 C32.1 18.67,4.99 R16.1
N$41  (via drill 0.35)
  Top 0.152: U7.3 14.35,8.47 v14.35,8.38 | X3.11 5.73,10.41 8.26,10.41 v10.03,8.64 10.8,7.87 10.8,6.1 11.3,5.59 15.11,5.59 15.88,4.83 R16.2
  Bottom 0.152: v14.35,8.38 10.29,8.38 v10.03,8.64
PDWN  (via drill 0.35)
  Top 0.152: U1.35 29.53,12.49 29.27,12.24 29.27,10.48 v29.34,10.41
  Bottom 0.152: U6.5 41.02,5.33 37.72,8.64 30.86,8.64 29.34,10.16 v29.34,10.41
RST  (via drill 0.35)
  Top 0.152: U1.36 30.51,12.95 v24.77,12.95
  Bottom 0.152: v24.77,12.95 24.77,9.91 29.59,5.08 30.35,5.08 31.88,5.08 32.38,4.57 32.38,3.81 32.38,3.05 U6.8
START  (via drill 0.35)
  Top 0.152: U1.38 30.52,13.97 29.85,13.97 v28.57,15.24
  Bottom 0.152: U6.3 46.1,5.84 40.51,11.43 31.88,11.43 30.35,12.95 30.35,13.46 v28.57,15.24
VCC
  Top 0.254: U2.3 11.75,3.49 11.56,3.3 9.78,3.3 | 9.78,3.3 8,3.3 | U2.1 9.85,3.37 9.78,3.3
  Top 0.406: U6.18 8,3.3 C20.1

### Text on the board
bNames: P | Potyplex | P | PotyEEG - Brazil